# EAGLE design ftExtender (EAGLE 9.0.0)
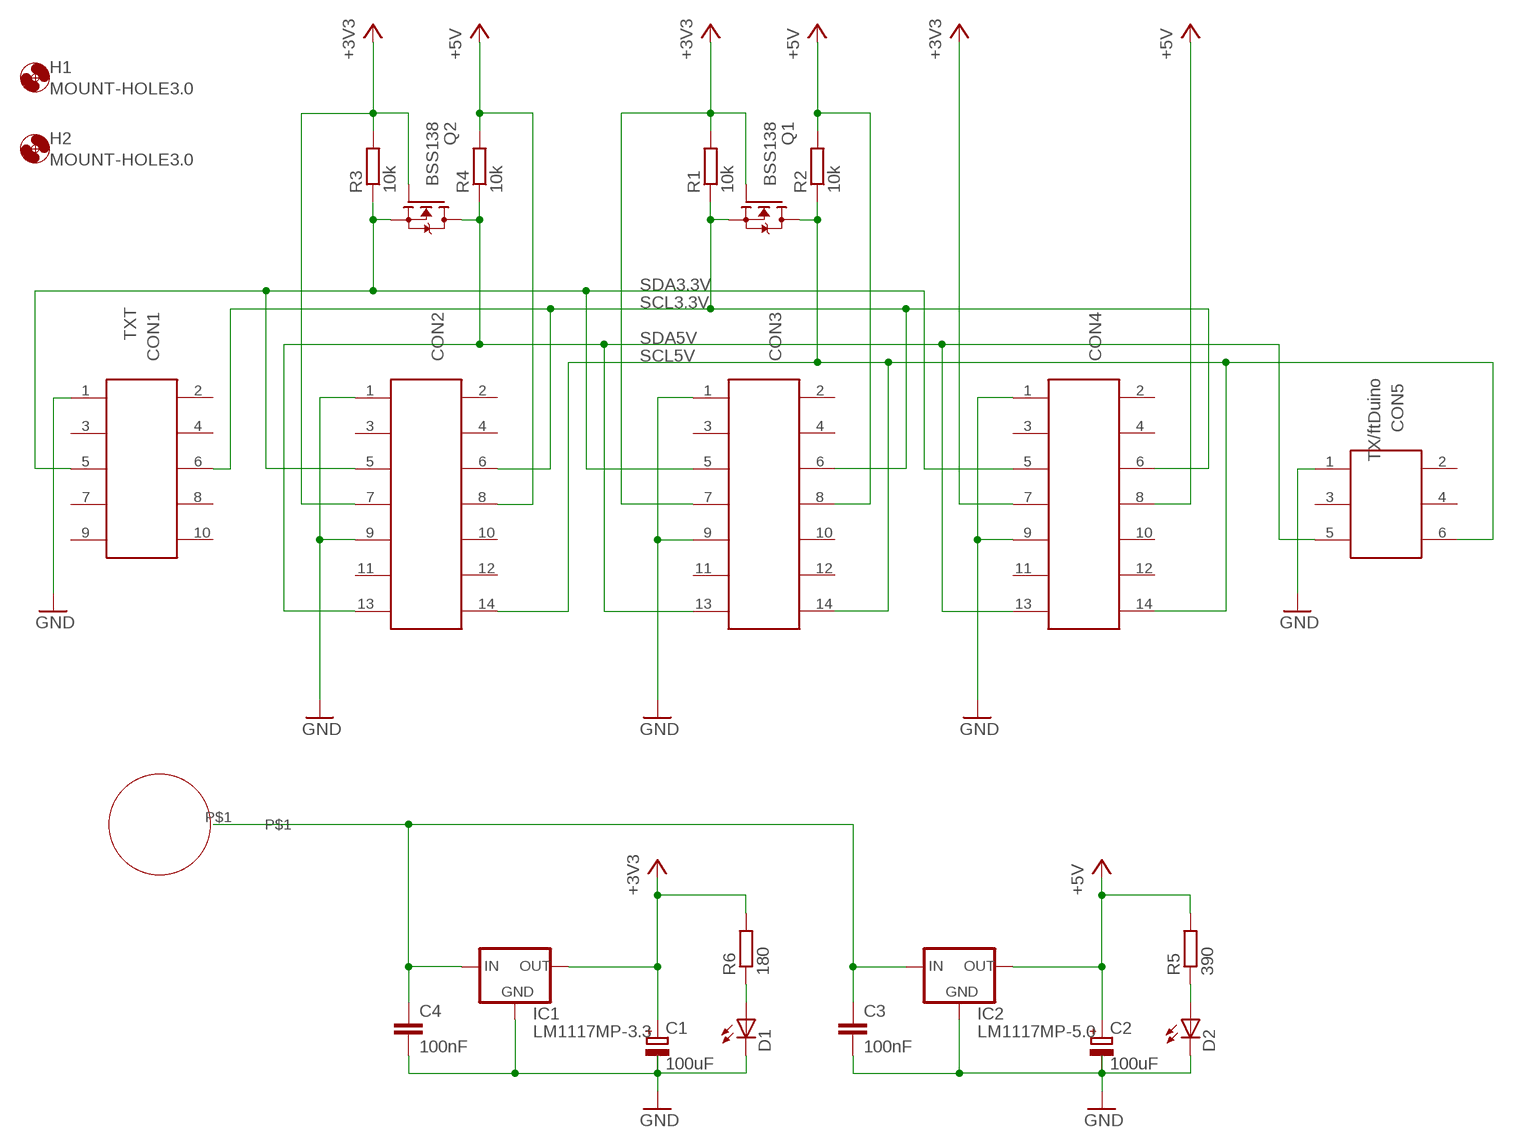
[diagram p0: schematic, sheet 1]

## Parts
+9V  BUNDHUELSE  [BUNDHUELSE]
C1  100uF  CPOL-EUCT3528  [CT3528]
C2  100uF  CPOL-EUCT3528  [CT3528]
C3  100nF  C-EUC0603K  [C0603K]
C4  100nF  C-EUC0603K  [C0603K]
CON1  TXT  612X1020621  [612X1020621]
CON2  612X1420621  [612X1420621]
CON3  612X1420621  [612X1420621]
CON4  612X1420621  [612X1420621]
CON5  TX/ftDuino  SMTHEADER06  [SMTHEADER06]
D1  LEDCHIP-LED0805  [CHIP-LED0805]
D2  LEDCHIP-LED0805  [CHIP-LED0805]
H1  MOUNT-HOLE3.0  [3,0]
H2  MOUNT-HOLE3.0  [3,0]
IC1  LM1117MP-3.3  [SOT223]
IC2  LM1117MP-5.0  [SOT223]
Q1  BSS138  [SOT23]
Q2  BSS138  [SOT23]
R1  10k  R-EU_R0603  [R0603]
R2  10k  R-EU_R0603  [R0603]
R3  10k  R-EU_R0603  [R0603]
R4  10k  R-EU_R0603  [R0603]
R5  390  R-EU_R0603  [R0603]
R6  180  R-EU_R0603  [R0603]

## Nets
+3V3: C1.-(+) CON2.7 CON3.7 CON4.7 IC1.2(OUT) IC1.4(OUT) Q1.1(G) Q2.1(G) R1.2 R3.2 R6.2
+5V: C2.-(+) CON2.8 CON3.8 CON4.8 IC2.2(OUT) IC2.4(OUT) R2.2 R4.2 R5.2
+9V: +9V.P$1 C3.1 C4.1 IC1.3(IN) IC2.3(IN)
GND: C1.+(-) C2.+(-) C3.2 C4.2 CON1.1 CON2.1 CON2.9 CON3.1 CON3.9 CON4.1 CON4.9 CON5.1 D1.C D2.C IC1.1(GND) IC2.1(GND)
N$4: D2.A R5.1
N$6: D1.A R6.1
SCL3.3V: CON1.6 CON2.6 CON3.6 CON4.6 Q1.2(S) R1.1
SCL5V: CON2.14 CON3.14 CON4.14 CON5.6 Q1.3(D) R2.1
SDA3.3V: CON1.5 CON2.5 CON3.5 CON4.5 Q2.2(S) R3.1
SDA5V: CON2.13 CON3.13 CON4.13 CON5.5 Q2.3(D) R4.1
Unconnected: CON1.2 CON1.3 CON1.4 CON1.7 CON1.8 CON1.9 CON1.10 CON2.2 CON2.3 CON2.4 CON2.10 CON2.11 CON2.12 CON3.2 CON3.3 CON3.4 CON3.10 CON3.11 CON3.12 CON4.2 CON4.3 CON4.4 CON4.10 CON4.11 CON4.12 CON5.2 CON5.3 CON5.4

## Library data of the parts
+9V = sflib:BUNDHUELSE
C1 C2 = resistor:CPOL-EU: POLARIZED CAPACITOR, European symbol
C3 C4 = resistor:C-EU: CAPACITOR, European symbol
CON1 = Wire-to-Board (rev17c):612X1020621: WR-BHD 2.54mm Male SMT Box Header High Temperature, 10 Pins=>Code : Con_WTB_BHD_2.54_Male_SMT_612X1020621(X=0;X=3) <http://katalog.we-online.de/media/thumbs2/eican/thb_Con_WTB_BHD_2.54_Male_SMT_6120xx20621_pf2.jpg> Details see: 6123XX20621: http://katalog.we-online.de/en/em/BHD_2_54_SMT_MALE_BOX_HEADER_REEL_6123XX20621 6120XX20621: http://katalog.we-online.de/en/em/612_0xx_206_21 Created 2014-06-05, Karrer Zheng 2014 (C) Würth Elektronik
CON2-CON4 = Wire-to-Board (rev17c):612X1420621: WR-BHD 2.54mm Male SMT Box Header High Temperature, 14 Pins=>Code : Con_WTB_BHD_2.54_Male_SMT_612X1420621(X=0;X=3) <http://katalog.we-online.de/media/thumbs2/eican/thb_Con_WTB_BHD_2.54_Male_SMT_6120xx20621_pf2.jpg> 6123XX20621: http://katalog.we-online.de/en/em/BHD_2_54_SMT_MALE_BOX_HEADER_REEL_6123XX20621 6120XX20621: http://katalog.we-online.de/en/em/612_0xx_206_21 Created 2014-06-05, Karrer Zheng 2014 (C) Würth Elektronik
CON5 = sflib:SMTHEADER06
D1 D2 = led:LED: LED OSRAM: - CHIPLED LG R971, LG N971, LY N971, LG Q971, LY Q971, LO R971, LY R971 LH N974, LH R974 LS Q976, LO Q976, LY Q976 LO Q996 - Hyper CHIPLED LW Q18S LB Q993, LB Q99A, LB R99A - SideLED LS A670, LO A670, LY A670, LG A670, LP A670 LB A673, LV A673, LT A673, LW A673 LH A674 LY A675 LS A676, LA A676, LO A676, LY A676, LW A676 LS A679, LY A679, LG A679 - Hyper Micro SIDELED® LS Y876, LA Y876, LO Y876, LY Y876 LT Y87S - SmartLED LW L88C, LW L88S LB L89C, LB L89S, LG L890 LS L89K, LO L89K, LY L89K LS L896, LA L896, LO L896, LY L896 - TOPLED LS T670, LO T670, LY T670, LG T670, LP T670 LSG T670, LSP T670, LSY T670, LOP T670, LYG T670 LG T671, LOG T671, LSG T671 LB T673, LV T673, LT T673, LW T673 LH T674 LS T676, LA T676, LO T676, LY T676, LB T676, LH T676, LSB T676, LW T676 LB T67C, LV T67C, LT T67C, LS T67K, LO T67K, LY T67K, LW E67C LS E67B, LA E67B, LO E67B, LY E67B, LB E67C, LV E67C, LT E67C LW T67C LS T679, LY T679, LG T679 LS T770, LO T770, LY T770, LG T770, LP T770 LB T773, LV T773, LT T773, LW T773 LH T774 LS E675, LA E675, LY E675, LS T675 LS T776, LA T776, LO T776, LY T776, LB T776 LHGB T686 LT T68C, LB T68C - Hyper Mini TOPLED® LB M676 - Mini TOPLED Santana® LG M470 LS M47K, LO M47K, LY M47K Source: http://www.osram.convergy.de LUXEON: - LUMILED® LXK2-PW12-R00, LXK2-PW12-S00, LXK2-PW14-U00, LXK2-PW14-V00 LXK2-PM12-R00, LXK2-PM12-S00, LXK2-PM14-U00 LXK2-PE12-Q00, LXK2-PE12-R00, LXK2-PE12-S00, LXK2-PE14-T00, LXK2-PE14-U00 LXK2-PB12-K00, LXK2-PB12-L00, LXK2-PB12-M00, LXK2-PB14-N00, LXK2-PB14-P00, LXK2-PB14-Q00 LXK2-PR12-L00, LXK2-PR12-M00, LXK2-PR14-Q00, LXK2-PR14-R00 LXK2-PD12-Q00, LXK2-PD12-R00, LXK2-PD12-S00 LXK2-PH12-R00, LXK2-PH12-S00 LXK2-PL12-P00, LXK2-PL12-Q00, LXK2-PL12-R00 Source: www.luxeon.com KINGBRIGHT: KA-3528ASYC Source: www.kingbright.com
H1 H2 = holes:MOUNT-HOLE: MOUNTING HOLE with drill center marker
IC1 = lm1117_10:LM1117?-*: 800mA Low-Dropout Linear Regulator Source: http://www.ti.com/lit/ds/symlink/lm1117-n.pdf; MF: Texas Instruments; MPN: LM1117MP-3.3; OC_FARNELL: 9778195; OC_NEWARK: 28X3416
IC2 = lm1117_10:LM1117?-*: 800mA Low-Dropout Linear Regulator Source: http://www.ti.com/lit/ds/symlink/lm1117-n.pdf; MF: Texas Instruments; MPN: LM1117MP-5.0; OC_FARNELL: 9778209; OC_NEWARK: 28X3417
Q1 Q2 = bss138_10:BSS138: BSS138 N-Channel Logic Level Enhancement Mode Field Effect Transistor Source: http://www.fairchildsemi.com/datasheets/BS/BSS138.pdf; MF: Fairchild; MPN: BSS138; OC_FARNELL: 9845330; OC_NEWARK: 67R2009
R1-R6 = resistor:R-EU_: RESISTOR, European symbol

## Board
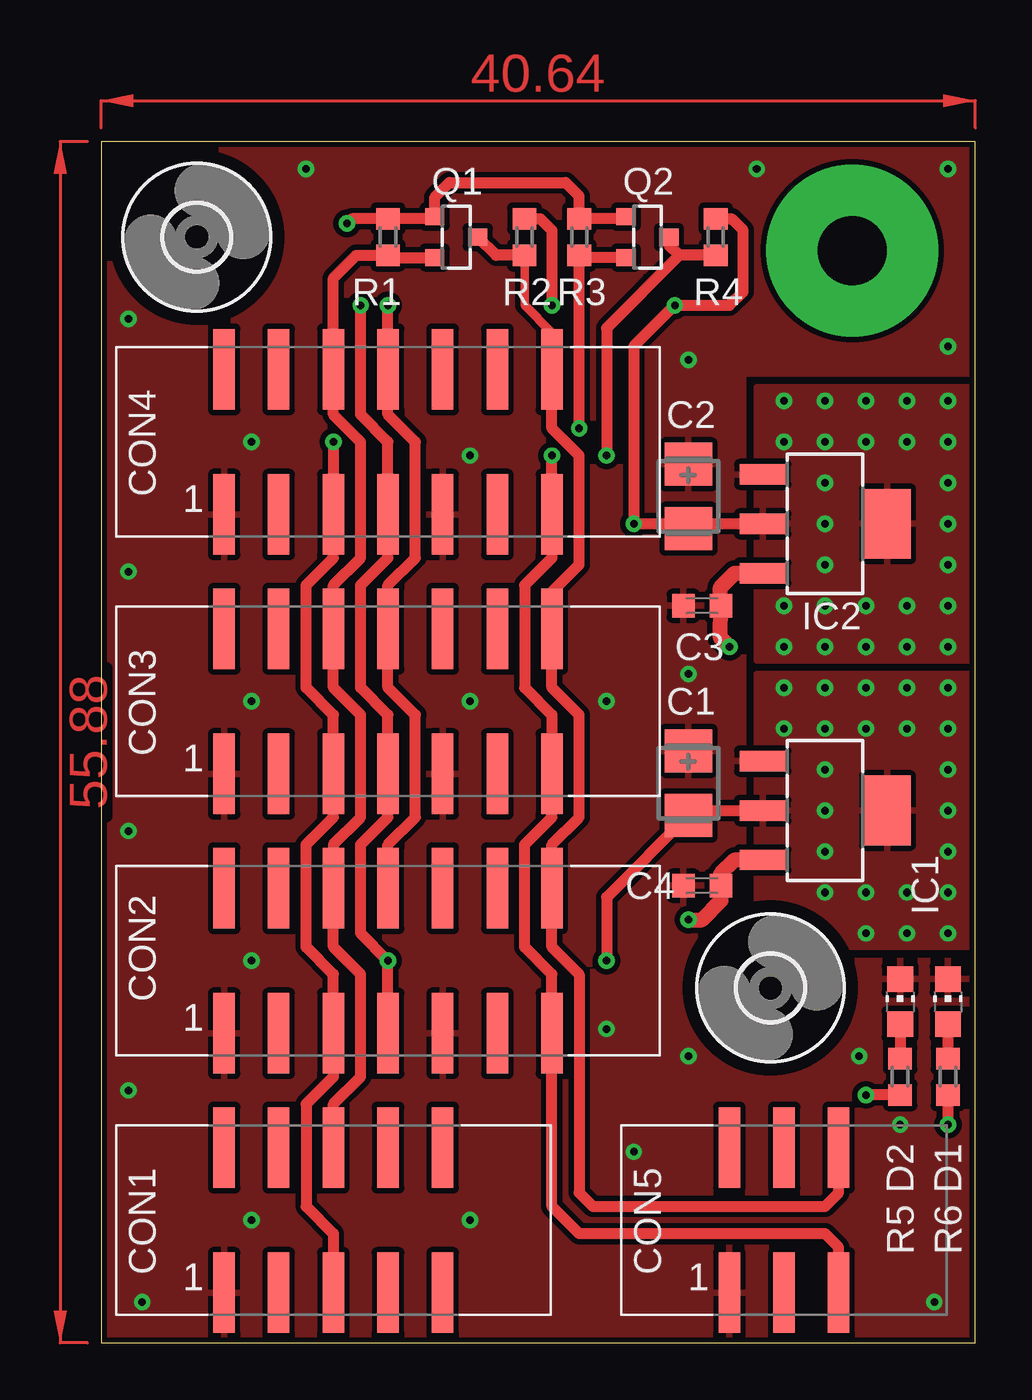
[diagram p1: board, top side]
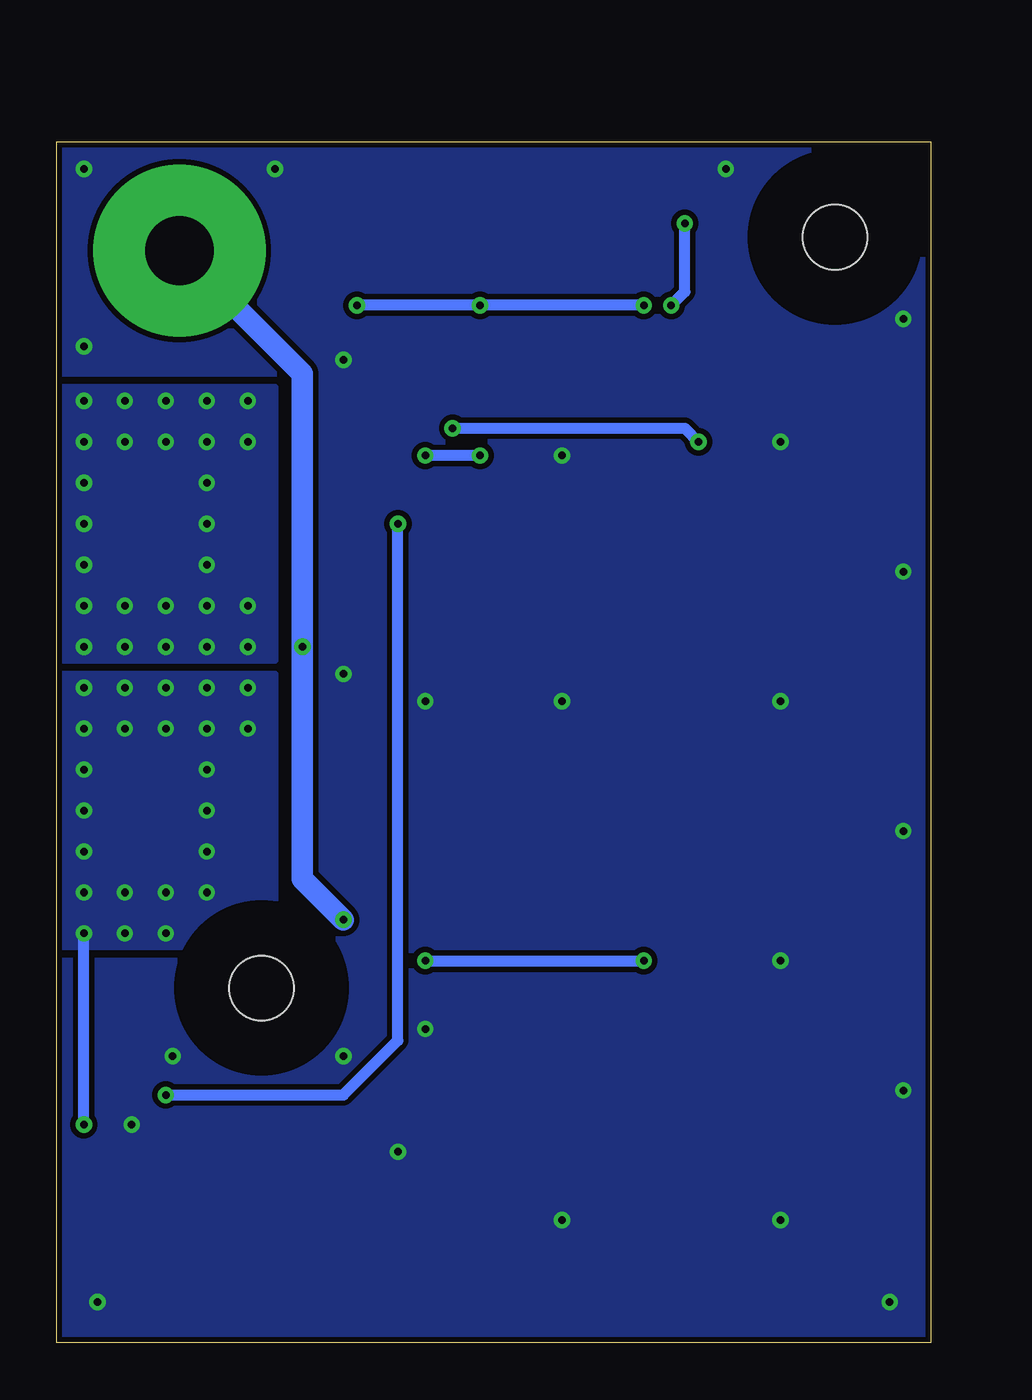
[diagram p2: board, bottom side, seen from below]

Size 40.64 x 55.87 mm. Coordinates in mm from the lower left corner, seen from the top.
Outline: 0,0 40.64,0 40.64,55.87 0,55.87 0,0
Copper layers (1*16): Top 0.035mm / dielectric 1.5mm / Bottom 0.035mm
Design rules "default *": minimum track width 6mil, minimum drill 0.35mm, track to track 10mil, track to pad 10mil, pad to pad 10mil, via to via 10mil, smd to smd 10mil, copper to edge 10mil, drill to drill 10mil, minimum pad ring 10mil, minimum via ring 8mil, stop-mask expansion 4mil, vias tented up to drill 0mil, thermal gap 10mil

### Footprints (pad centres in the part's own frame; a part is rotated, then mirrored left to right if it is on the bottom)
BUNDHUELSE = drill 3.2 pad 8: P$1 0,0
CT3528 = smd 2 x 2.2: + -1.5,0; - 1.5,0
C0603K = smd 1.05 x 1.08: 1 -0.875,0; 2 0.875,0
612X1020621 = smd 1 x 3.75: 1 -5.08,-3.375; 2 -5.08,3.375; 3 -2.54,-3.375; 4 -2.54,3.375; 5 0,-3.375; 6 0,3.375; 7 2.54,-3.375; 8 2.54,3.375; 9 5.08,-3.375; 10 5.08,3.375
612X1420621 = smd 1 x 3.75: 1 -7.62,-3.375; 2 -7.62,3.375; 3 -5.08,-3.375; 4 -5.08,3.375; 5 -2.54,-3.375; 6 -2.54,3.375; 7 0,-3.375; 8 0,3.375; 9 2.54,-3.375; 10 2.54,3.375; 11 5.08,-3.375; 12 5.08,3.375; 13 7.62,-3.375; 14 7.62,3.375
SMTHEADER06 = smd 1 x 3.75: 1 -5.08,-3.375; 2 -5.08,3.375; 3 -2.54,-3.375; 4 -2.54,3.375; 5 0,-3.375; 6 0,3.375
CHIP-LED0805 = smd 1.2 x 1.2: A 0,-1.05; C 0,1.05
3,0 = hole 3: 0,0
SOT223 = smd 0.95 x 2.15: 1 -2.3,-2.9; 2 0,-2.9; 3 2.3,-2.9 | smd 3.25 x 2.15: 4 0,2.9
SOT23 = smd 0.8 x 0.9: 1 -0.95,-1; 2 0.95,-1; 3 0,1
R0603 = smd 1 x 1.1: 1 -0.85,0; 2 0.85,0

### Placement (x,y rotation side)
+9V  34.92,50.8 0 top
C1  27.3,26.04 270 top
C2  27.3,39.37 270 top
C3  27.94,34.29 180 top
C4  27.94,21.27 180 top
CON1  10.79,5.71 0 top
CON2  13.34,17.78 0 top
CON3  13.34,29.84 0 top
CON4  13.34,41.91 0 top
CON5  34.29,5.71 0 top
D1  39.37,15.88 0 top
D2  37.15,15.88 0 top
H1  31.11,16.51 0 top
H2  4.45,51.44 0 top
IC1  33.66,24.77 270 top
IC2  33.66,38.1 270 top
Q1  16.51,51.44 270 top
Q2  25.4,51.44 270 top
R1  13.34,51.44 90 top
R2  19.68,51.44 90 top
R3  22.23,51.44 90 top
R4  28.57,51.44 90 top
R5  37.15,12.38 270 top
R6  39.37,12.38 270 top

### Tracks (layer width: path | path; a pad name or v marks a point on that pad's centre or on a via)
+3V3  (via drill 0.35)
  Top 0.5: CON3.7 13.34,24.45 12.06,23.18 | CON2.7 v13.34,17.78 | 12.06,30.48 12.06,35.24 13.34,36.51 | Q2.1 24.3,52.28 R3.2 22.23,53.34 21.59,53.98 16.19,53.98 15.51,53.29 Q1.1 15.41,52.28 R1.2 11.64,52.28 v11.43,52.07 | CON4.7 13.34,41.91 12.06,43.18 v12.06,48.26 | IC1.2 27.54,24.77 C1.- 23.5,20.73 v23.5,17.78 | R6.2 v39.37,10.16
  Top 0.508: v13.34,17.78 12.06,19.05 12.06,23.18 | CON3.7 13.34,29.21 12.06,30.48 | 13.34,36.51 CON4.7
  Bottom 0.5: v12.06,48.26 11.43,48.9 v11.43,52.07 | v39.37,10.16 v39.37,19.05
  Bottom 0.508: v23.5,17.78 v13.34,17.78
  other vias: 31.75,30.48 33.66,30.48 35.56,30.48 37.47,30.48 39.37,30.48 39.37,28.57 39.37,26.67 39.37,24.77 39.37,22.86 35.56,19.05 37.47,20.95 35.56,20.95 33.66,20.95 33.66,22.86 33.66,24.77 33.66,26.67 33.66,28.57 35.56,28.57 37.47,28.57 31.75,28.57 37.47,19.05 39.37,20.95
  pour Top: 30.48,31.11 40.64,31.11 40.64,18.41 30.48,18.41
  pour Bottom: 30.48,31.11 40.64,31.11 40.64,18.41 30.48,18.41
+5V  (via drill 0.35)
  Top 0.5: 13.34,23.18 14.61,24.45 14.61,29.21 | 13.34,30.48 CON3.8 13.34,35.24 14.61,36.51 | C2.- 27.54,38.1 IC2.2 v24.77,38.1 24.77,46.35 v26.67,48.26 29.21,48.26 29.84,48.9 29.84,51.75 29.31,52.28 R4.2 | R2.2 20.42,52.28 20.95,51.75 v20.95,48.26 | R5.2 v35.56,11.53
  Top 0.508: CON2.8 13.34,23.18 | 14.61,29.21 13.34,30.48 | 14.61,36.51 14.61,41.91 13.34,43.18 CON4.8 v13.34,48.26
  Bottom 0.5: v35.56,11.53 27.3,11.53 24.77,14.07 v24.77,38.1
  Bottom 0.508: v13.34,48.26 v20.95,48.26 v26.67,48.26
  other vias: 31.75,32.38 39.37,32.38 39.37,34.29 39.37,36.2 39.37,38.1 39.37,40.01 39.37,41.91 39.37,43.81 37.47,43.81 37.47,41.91 35.56,41.91 33.66,41.91 31.75,41.91 31.75,43.81 33.66,43.81 35.56,43.81 33.66,40.01 33.66,38.1 33.66,36.2 33.66,34.29 35.56,34.29 37.47,34.29 37.47,32.38 35.56,32.38 33.66,32.38 31.75,34.29
  pour Top: 30.48,44.45 40.64,44.45 40.64,31.75 30.48,31.75
  pour Bottom: 30.48,31.75 40.64,31.75 40.64,44.45 30.48,44.45
+9V  (via drill 0.35)
  Top 0.7: v29.21,32.38 28.79,32.8 C3.1 28.79,35.14 29.45,35.8 IC2.3 | IC1.3 29.45,22.46 28.79,21.8 C4.1 28.82,20.56 27.94,19.68 v27.3,19.68
  Bottom 1: +9V.P$1 29.21,45.09 v29.21,32.38 29.21,21.59 v27.3,19.68
GND  (via drill 0.35)
  other vias: 38.73,1.91 1.91,1.91 39.37,54.61 39.37,46.35 9.53,54.61 23.5,29.84 17.14,29.84 6.99,29.84 6.99,41.91 17.14,41.27 6.99,17.78 17.14,5.71 6.99,5.71 24.77,8.89 23.5,14.61 1.27,47.62 27.3,45.72 30.48,54.61 27.3,31.11 27.3,13.34 35.24,13.34 1.27,35.88 1.27,23.81 1.27,11.75 37.15,10.16
  pour Top: 0,55.88 40.64,55.88 40.64,45.09 29.84,45.09 29.84,17.78 40.64,17.78 40.64,0 0,0
  pour Bottom: 0,55.88 40.64,55.88 40.64,45.09 29.84,45.09 29.84,17.78 40.64,17.78 40.64,0 0,0
N$4
  Top 0.5: D2.A R5.1
N$6
  Top 0.5: D1.A R6.1
SCL3.3V
  Top 0.5: CON1.6 10.79,11.11 12.06,12.38 12.06,17.14 10.79,18.41 CON2.6 10.79,23.18 12.06,24.45 12.06,29.21 10.79,30.48 CON3.6 10.79,35.24 12.06,36.51 12.06,41.91 10.79,43.18 CON4.6 10.79,49.53 11.85,50.59 R1.1 13.44,50.48 Q1.2
SCL5V
  Top 0.406: CON4.14 20.95,46.99 19.68,48.26 R2.1
  Top 0.5: CON4.14 20.95,42.55 22.23,41.27 22.23,36.2 20.95,34.92 CON3.14 20.95,30.48 22.23,29.21 22.23,24.45 20.95,23.18 CON2.14 20.95,18.41 22.23,17.14 22.23,6.99 22.86,6.35 33.66,6.35 34.29,6.99 CON5.6 | R2.1 18.36,50.59 Q1.3
SDA3.3V  (via drill 0.35)
  Top 0.305: 22.32,50.48 R3.1
  Top 0.5: CON1.5 10.79,5.08 9.53,6.35 9.53,11.11 10.79,12.38 CON2.5 10.79,17.14 9.53,18.41 9.53,23.18 10.79,24.45 CON3.5 10.79,29.21 9.53,30.48 9.53,35.24 10.79,36.51 CON4.5 v10.79,41.91 | Q2.2 22.32,50.48 | v22.23,42.55 R3.1
  Bottom 0.5: v22.23,42.55 11.43,42.55 v10.79,41.91
SDA5V  (via drill 0.35)
  Top 0.5: CON5.5 34.29,4.45 33.66,5.08 22.23,5.08 20.95,6.35 CON2.13 20.95,17.14 19.68,18.41 19.68,23.18 20.95,24.45 CON3.13 20.95,29.21 19.68,30.48 19.68,35.24 20.95,36.51 CON4.13 v20.95,41.27 | v23.5,41.27 23.5,47.2 26.89,50.59 | R4.1 26.89,50.59 | 26.89,50.59 26.4,51.07 Q2.3
  Bottom 0.5: v20.95,41.27 v23.5,41.27
(copper drawn outside any net)
  shapes: Top area x2